# EAGLE board Powersupply_RevA_discrete (EAGLE 9.4.2), part 1 of 2
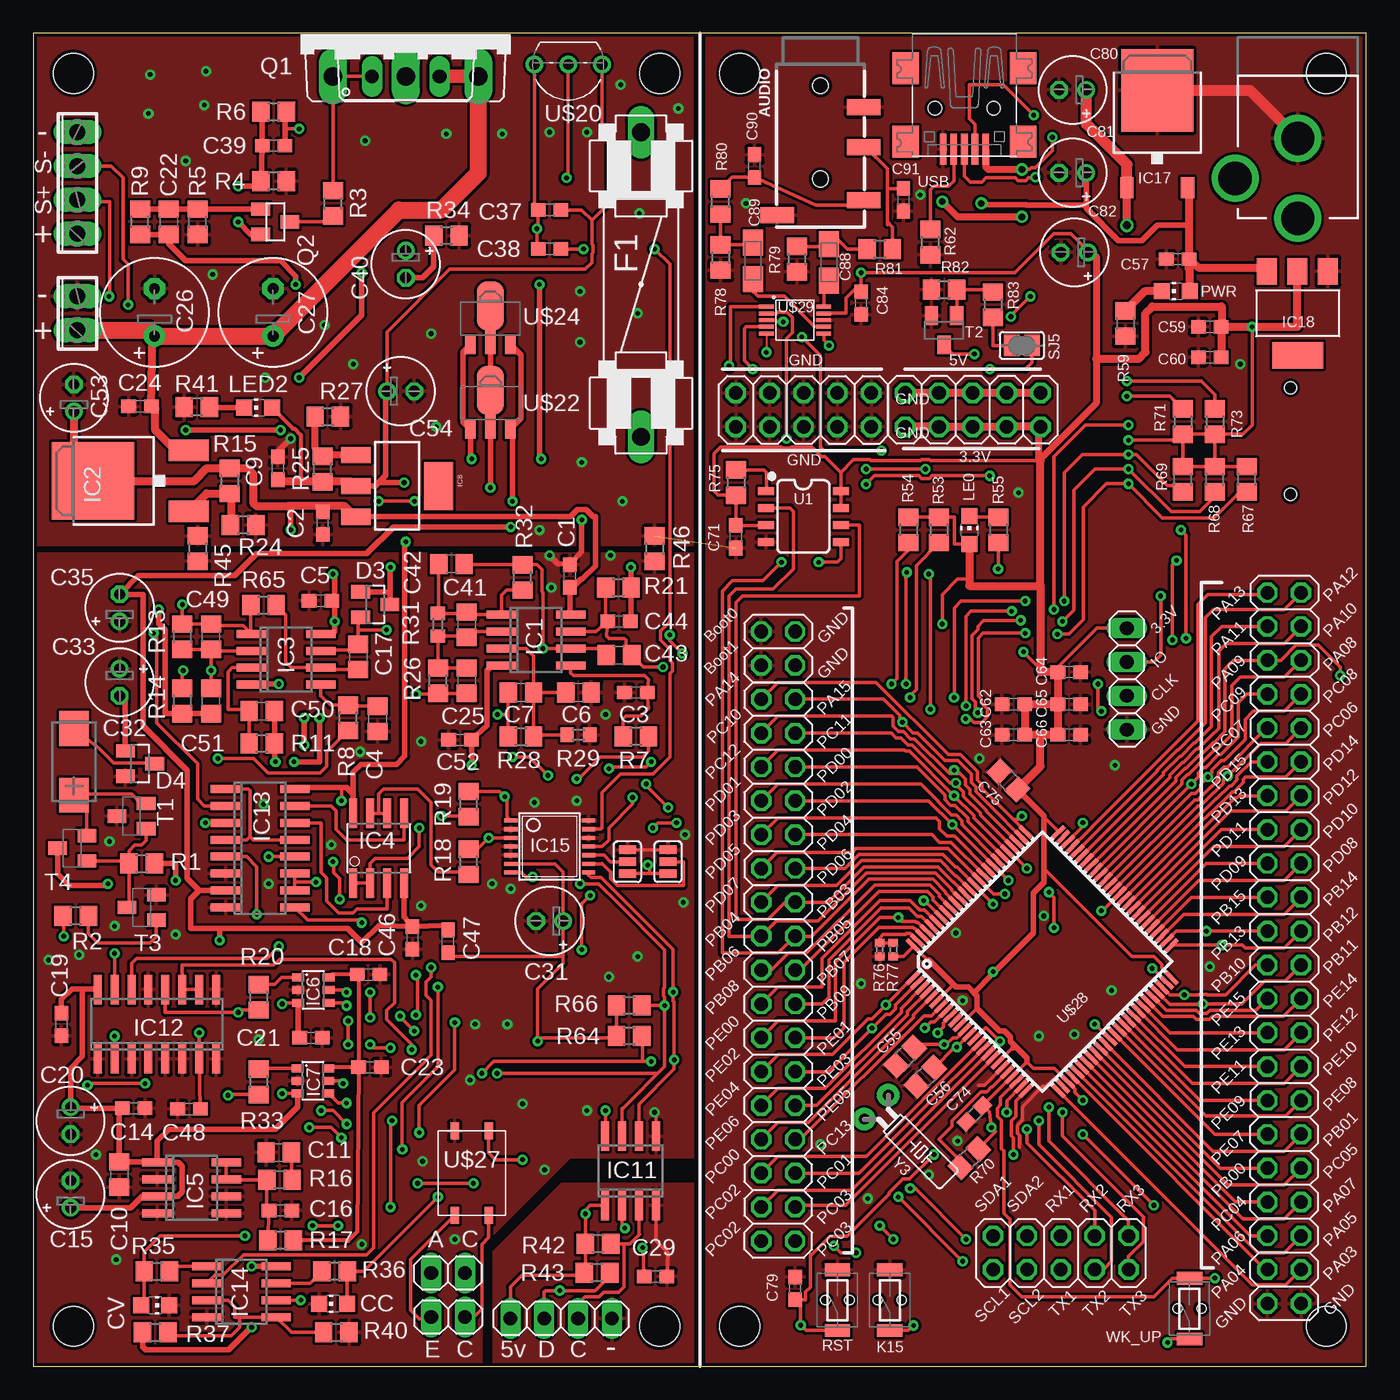
[diagram p2: board, top side]
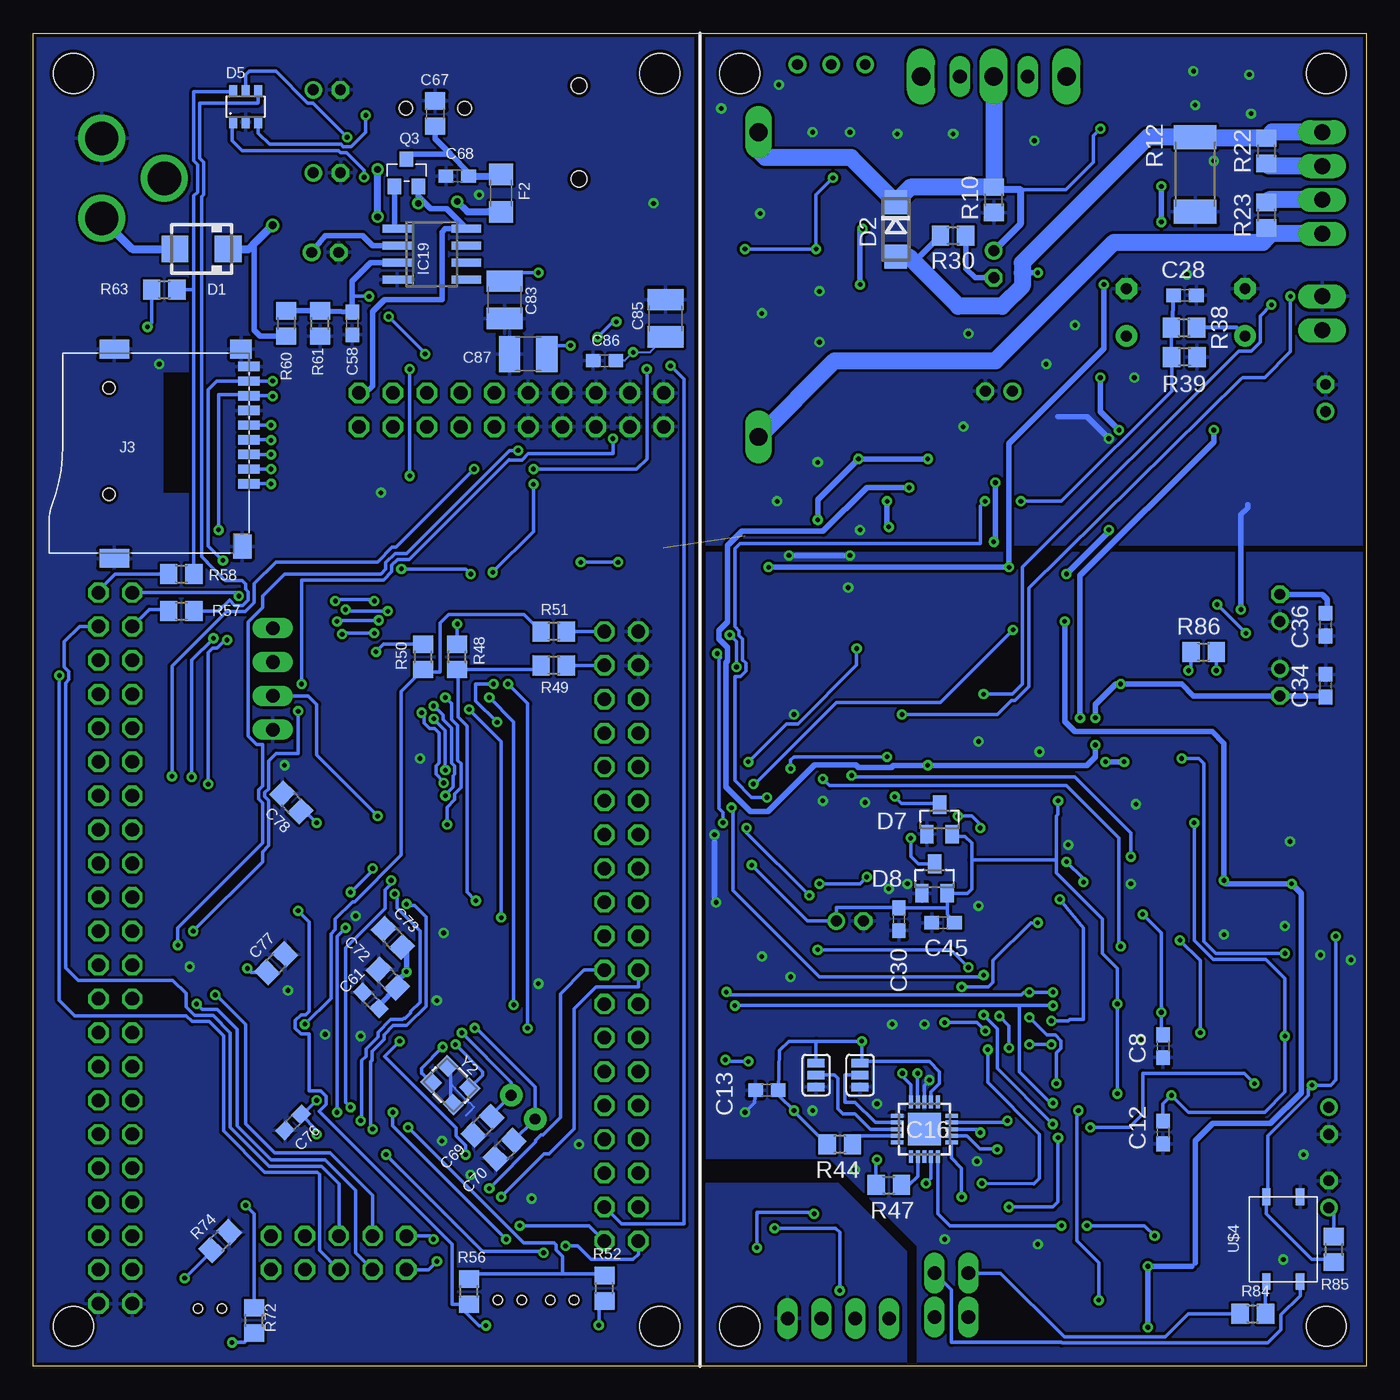
[diagram p3: board, bottom side, seen from below]

Size 100 x 100 mm. Coordinates in mm from the lower left corner, seen from the top.
Outline: 0,0 100,0 100,100 0,100 0,0
Copper layers (1*16): Top 0.035mm / dielectric 1.5mm / Bottom 0.035mm
Design rules "default *": minimum track width 6mil, minimum drill 0.35mm, track to track 6mil, track to pad 6mil, pad to pad 6mil, via to via 6mil, smd to smd 6mil, copper to edge 10mil, drill to drill 6mil, minimum pad ring 10mil, minimum via ring 8mil, stop-mask expansion 8mil, vias tented up to drill 0mil, thermal gap 10mil
Net classes: 0 default: clearance 0.205 mm
Holes 3 mm at 3,97 47,97 3,3 47,3 53,3 97,3 53,97 97,97

## Footprints (pad centres in the part's own frame; a part is rotated, then mirrored left to right if it is on the bottom)
AUDIO_JACK_3.5MM_TRRS_SMD_RA = smd 1.2 x 2.5: EARTH 11.3,-3.25; RING1 6.2,3.25; RING2 3.2,3.25; TIP 10.2,3.25 | hole 1.2: 1.6,0; 8.6,0
C0603 = smd 1.1 x 1: 1 -0.85,0; 2 0.85,0
C0805 = smd 1.3 x 1.5: 1 -0.95,0; 2 0.95,0
E2-5 = drill 0.813 pad 1.27: + -1.016,0 | drill 0.813 pad 1.27 octagon: - 1.016,0
E3,5-8 = drill 0.813 pad 1.6: + -1.778,0 | drill 0.813 pad 1.6 octagon: - 1.778,0
CT6032 = smd 2.6 x 2.2: + -2.5,0; - 2.5,0
C1210 = smd 1.6 x 2.7: 1 -1.4,0; 2 1.4,0
A/3216-18R = smd 1.95 x 1.5: + 1.375,0; - -1.375,0
CHIP-LED0805 = smd 1.2 x 1.2: A 0,-1.05; C 0,1.05
SMA = smd 2 x 2: A 2,0; C -2,0
DO214AC = smd 1.8 x 1.7: A 2.05,0; C -2.05,0
SOT23 = smd 1 x 1.4: 1 -0.95,-1.1; 2 0.95,-1.1; 3 0,1.1
SOT23-6 = smd 0.6 x 0.9: 1 -0.95,-1.15; 2 0,-1.15; 3 0.95,-1.15; 4 0.95,1.15; 5 0,1.15; 6 -0.95,1.15
FUSE = drill 1.321 long: 1 -11.43,0; 2 11.43,0
1206 = smd 1.6 x 1.8: 1 -1.4,0; 2 1.4,0
SO08 = smd 0.6 x 2.2: 1 -1.905,-2.6; 2 -0.635,-2.6; 3 0.635,-2.6; 4 1.905,-2.6; 5 1.905,2.6; 6 0.635,2.6; 7 -0.635,2.6; 8 -1.905,2.6
DPACK = smd 1.6 x 3: 1 -2.28,-4.8; 3 2.28,-4.8 | smd 5.8 x 6.2: 4 0,2.38
SO08' = smd 0.61 x 2.21: 1 -1.905,-2.616; 2 -0.635,-2.616; 3 0.635,-2.616; 4 1.905,-2.616; 5 1.905,2.616; 6 0.635,2.616; 7 -0.635,2.616; 8 -1.905,2.616
SO-08 = smd 0.6 x 2.2: 1 -1.905,-2.6; 2 -0.635,-2.6; 3 0.635,-2.6; 4 1.905,-2.6; 5 1.905,2.6; 6 0.635,2.6; 7 -0.635,2.6; 8 -1.905,2.6
SOT223 = smd 1.219 x 2.235: 1 -2.311,-3.099; 2 0,-3.099; 3 2.311,-3.099 | smd 3.6 x 2.2: 4 0,3.099
SO16 = smd 0.6 x 2.2: 1 -4.445,-2.6; 2 -3.175,-2.6; 3 -1.905,-2.6; 4 -0.635,-2.6; 5 0.635,-2.6; 6 1.905,-2.6; 7 3.175,-2.6; 8 4.445,-2.6; 9 4.445,2.6; 10 3.175,2.6; 11 1.905,2.6; 12 0.635,2.6; 13 -0.635,2.6; 14 -1.905,2.6; 15 -3.175,2.6; 16 -4.445,2.6
TSSOP14 = smd 0.305 x 0.991: 1 -1.95,-2.918; 2 -1.3,-2.918; 3 -0.65,-2.918; 4 0,-2.918; 5 0.65,-2.918; 6 1.3,-2.918; 7 1.95,-2.918; 8 1.95,2.918; 9 1.3,2.918; 10 0.65,2.918; 11 0,2.918; 12 -0.65,2.918; 13 -1.3,2.918; 14 -1.95,2.918
QFN20 = smd 0.95 x 0.3: 1 -2.05,1; 2 -2.05,0.5; 3 -2.05,0; 4 -2.05,-0.5; 5 -2.05,-1; 11 2.05,-1; 12 2.05,-0.5; 13 2.05,0; 14 2.05,0.5; 15 2.05,1 | smd 0.3 x 0.95: 6 -1,-2.05; 7 -0.5,-2.05; 8 0,-2.05; 9 0.5,-2.05; 10 1,-2.05; 16 1,2.05; 17 0.5,2.05; 18 0,2.05; 19 -0.5,2.05; 20 -1,2.05 | smd 2.45 x 2.45: EXP 0,0
TO252 = smd 1 x 1.6: 1 -2.28,-4.8; 2 2.28,-4.8 | smd 5.4 x 6.2: 3 0,2.5
SOT223' = smd 1.499 x 2.007: 1 -2.261,-3.15; 2 0.025,-3.15; 3 2.311,-3.15 | smd 3.81 x 2.007: 4 0,3.15
POWER_JACK_PTH = drill 2.5: GND 0,7.7; GNDBREAK 4.7,10.7; PWR 0,13.7
MICRO-SD9+4P-SMD-16.1X14.5X1.85MM = smd 1.6 x 0.7: 1 0,2.25; 2 0,1.15; 3 0,0.05; 4 0,-1.05; 5 0,-2.15; 6 0,-3.25; 7 0,-4.35; 8 0,-5.45; 9 0,-6.55 | smd 1.6 x 1.4: G1 0.6,-7.85 | smd 2.2 x 1.4: G2 10.1,-7.85; G3 10.1,7.85 | smd 1.4 x 1.8: G4 0.5,6.95 | hole 0.9: 10.5,-4.95; 10.5,3.05
1X02 = drill 1.016 long: 1 -1.27,0; 2 1.27,0
2X22 = drill 1.016 octagon: 1 -25.4,-1.27; 2 -25.4,1.27; 3 -22.86,-1.27; 4 -22.86,1.27; 5 -20.32,-1.27; 6 -20.32,1.27; 7 -17.78,-1.27; 8 -17.78,1.27; 9 -15.24,-1.27; 10 -15.24,1.27; 11 -12.7,-1.27; 12 -12.7,1.27; 13 -10.16,-1.27; 14 -10.16,1.27; 15 -7.62,-1.27; 16 -7.62,1.27; 17 -5.08,-1.27; 18 -5.08,1.27; 19 -2.54,-1.27; 20 -2.54,1.27; 21 0,-1.27; 22 0,1.27; 23 2.54,-1.27; 24 2.54,1.27; 25 5.08,-1.27; 26 5.08,1.27; 27 7.62,-1.27; 28 7.62,1.27; 29 10.16,-1.27; 30 10.16,1.27; 31 12.7,-1.27; 32 12.7,1.27; 33 15.24,-1.27; 34 15.24,1.27; 35 17.78,-1.27; 36 17.78,1.27; 37 20.32,-1.27; 38 20.32,1.27; 39 22.86,-1.27; 40 22.86,1.27; 41 25.4,-1.27; 42 25.4,1.27; 43 27.94,-1.27; 44 27.94,1.27
2X17 = drill 1.016 octagon: 1 -20.32,-1.27; 2 -20.32,1.27; 3 -17.78,-1.27; 4 -17.78,1.27; 5 -15.24,-1.27; 6 -15.24,1.27; 7 -12.7,-1.27; 8 -12.7,1.27; 9 -10.16,-1.27; 10 -10.16,1.27; 11 -7.62,-1.27; 12 -7.62,1.27; 13 -5.08,-1.27; 14 -5.08,1.27; 15 -2.54,-1.27; 16 -2.54,1.27; 17 0,-1.27; 18 0,1.27; 19 2.54,-1.27; 20 2.54,1.27; 21 5.08,-1.27; 22 5.08,1.27; 23 7.62,-1.27; 24 7.62,1.27; 25 10.16,-1.27; 26 10.16,1.27; 27 12.7,-1.27; 28 12.7,1.27; 29 15.24,-1.27; 30 15.24,1.27; 31 17.78,-1.27; 32 17.78,1.27; 33 20.32,-1.27; 34 20.32,1.27
2X02 = drill 1.016 octagon: 1 -1.27,-1.27; 2 -1.27,1.27; 3 1.27,-1.27; 4 1.27,1.27
2X05 = drill 1.016 octagon: 1 -5.08,-1.27; 2 -5.08,1.27; 3 -2.54,-1.27; 4 -2.54,1.27; 5 0,-1.27; 6 0,1.27; 7 2.54,-1.27; 8 2.54,1.27; 9 5.08,-1.27; 10 5.08,1.27
TACTILE_SWITCH_SMD_6.0X3.5MM = smd 0.95 x 1.9: 1 -2.275,0; 2 2.275,0 | hole 0.7: 0,-0.9; 0,0.9
TOP3AV = drill 1.397 long: B -5.461,-3.175; C 0,-3.175; E 5.461,-3.175
SOT-23 = smd 1.016 x 1.143: 1 -0.889,-1.016; 2 0.889,-1.016; 3 0,1.016
TO220AV = drill 1.016 long: B -2.54,-2.54; C 0,-2.54; E 2.54,-2.54
R0805 = smd 1.3 x 1.5: 1 -0.95,0; 2 0.95,0
R2512 = smd 1.8 x 3.2: 1 -2.8,0; 2 2.8,0
R0603 = smd 1 x 1.1: 1 -0.85,0; 2 0.85,0
R0402 = smd 0.6 x 0.7: 1 -0.5,0; 2 0.5,0
SJ_3 = smd 0.635 x 1.27: 1 -0.889,0; 2 0,0; 3 0.889,0
SJ = smd 1.168 x 1.6: 1 -0.762,0; 2 0.762,0
1X04 = drill 1.016 long: 1 -3.81,0; 2 -1.27,0; 3 1.27,0; 4 3.81,0
SOT23-BEC = smd 1 x 1.4: B -0.95,-1.1; C 0,1.1; E 0.95,-1.1
SO08'' = smd 0.6 x 1.2: 1 -1.905,-2.8; 2 -0.635,-2.8; 3 0.635,-2.8; 4 1.905,-2.8; 5 1.905,2.8; 6 0.635,2.8; 7 -0.635,2.8; 8 -1.905,2.8
EL357 = smd 1.27 x 0.635: 1 -2.54,1.27; 2 -2.54,-1.27; 3 3.81,-1.27; 4 3.81,1.27
TO92-BCE = drill 0.813: 1 -2.54,0; 2 0,0; 3 2.54,0
SOT89 = smd 0.8 x 1.4: 1 -1.499,-1.981; 3 1.499,-1.981 | smd 0.8 x 1.9: 2 0,-1.727 | smd 2.032 x 3.65: 2@1 0,0.94
LQFP100 = smd 1.2 x 0.32: 1 -7.75,6; 2 -7.75,5.5; 3 -7.75,5; 4 -7.75,4.5; 5 -7.75,4; 6 -7.75,3.5; 7 -7.75,3; 8 -7.75,2.5; 9 -7.75,2; 10 -7.75,1.5; 11 -7.75,1; 12 -7.75,0.5; 13 -7.75,0; 14 -7.75,-0.5; 15 -7.75,-1; 16 -7.75,-1.5; 17 -7.75,-2; 18 -7.75,-2.5; 19 -7.75,-3; 20 -7.75,-3.5; 21 -7.75,-4; 22 -7.75,-4.5; 23 -7.75,-5; 24 -7.75,-5.5; 25 -7.75,-6; 51 7.75,-6; 52 7.75,-5.5; 53 7.75,-5; 54 7.75,-4.5; 55 7.75,-4; 56 7.75,-3.5; 57 7.75,-3; 58 7.75,-2.5; 59 7.75,-2; 60 7.75,-1.5; 61 7.75,-1; 62 7.75,-0.5; 63 7.75,0; 64 7.75,0.5; 65 7.75,1; 66 7.75,1.5; 67 7.75,2; 68 7.75,2.5; 69 7.75,3; 70 7.75,3.5; 71 7.75,4; 72 7.75,4.5; 73 7.75,5; 74 7.75,5.5; 75 7.75,6 | smd 0.32 x 1.2: 26 -6,-7.75; 27 -5.5,-7.75; 28 -5,-7.75; 29 -4.5,-7.75; 30 -4,-7.75; 31 -3.5,-7.75; 32 -3,-7.75; 33 -2.5,-7.75; 34 -2,-7.75; 35 -1.5,-7.75; 36 -1,-7.75; 37 -0.5,-7.75; 38 0,-7.75; 39 0.5,-7.75; 40 1,-7.75; 41 1.5,-7.75; 42 2,-7.75; 43 2.5,-7.75; 44 3,-7.75; 45 3.5,-7.75; 46 4,-7.75; 47 4.5,-7.75; 48 5,-7.75; 49 5.5,-7.75; 50 6,-7.75; 76 6,7.75; 77 5.5,7.75; 78 5,7.75; 79 4.5,7.75; 80 4,7.75; 81 3.5,7.75; 82 3,7.75; 83 2.5,7.75; 84 2,7.75; 85 1.5,7.75; 86 1,7.75; 87 0.5,7.75; 88 0,7.75; 89 -0.5,7.75; 90 -1,7.75; 91 -1.5,7.75; 92 -2,7.75; 93 -2.5,7.75; 94 -3,7.75; 95 -3.5,7.75; 96 -4,7.75; 97 -4.5,7.75; 98 -5,7.75; 99 -5.5,7.75; 100 -6,7.75
TSSOP10 = smd 0.3 x 1.1: 1 -1,-2.15; 2 -0.5,-2.15; 3 0,-2.15; 4 0.5,-2.15; 5 1,-2.15; 6 1,2.15; 7 0.5,2.15; 8 0,2.15; 9 -0.5,2.15; 10 -1,2.15
USB-MINIB = smd 0.5 x 2.308: D+ 0,4.064; D- -0.8,4.064; GND 1.6,4.064; ID 0.8,4.064; VBUS -1.6,4.064 | smd 2 x 2.4: GND1 -4.4,-2; GND2 -4.4,3.5; GND3 4.4,3.5; GND4 4.4,-2 | hole 1: -2.2,1; 2.2,1
4POL254 = drill 1.2 long: 1 -3.81,0; 2 -1.27,0; 3 1.27,0; 4 3.81,0
2POL254 = drill 1.2 long: 1 -1.27,0; 2 1.27,0
CRYSTAL-SMD-3.2X2.5MM = smd 1.2 x 1.1: 1 -1.175,-0.875; 2 1.175,-0.875; 3 1.175,0.875; 4 -1.175,0.875
CRYSTAL-PTH-2X6-CYL = drill 0.813 pad 1.676: 1 -1.27,0; 2 1.27,0

## Placement (x,y rotation side)
AUDIO  AUDIO_JACK_TRRSSMD_RA  [AUDIO_JACK_3.5MM_TRRS_SMD_RA]  59.05,97.66 270 top
C1  100nf  [C0603]  40.26,59.28 90 top
C2  100nf  [C0603]  21.72,63.26 90 top
C3  100nf  [C0603]  45.21,50.55 180 top
C4  100nf  [C0805]  25.83,48.56 270 top
C5  100nf  [C0603]  21.54,57.43 0 top
C6  4.7n  [C0805]  40.89,50.55 0 top
C7  4.7n  [C0805]  36.58,50.55 180 top
C8  100nf  [C0603]  15.24,24 90 bottom
C9  100nf  [C0603]  18.34,67.37 270 top
C10  2.2uf  [C0805]  6.45,14.38 90 top
C11  2.2uf  [C0805]  18.41,16.03 180 top
C12  100nf  [C0603]  15.24,17.53 90 bottom
C13  100nf  [C0603]  44.96,20.7 0 bottom
C14  100nf  [C0603]  7.53,19.35 180 top
C15  10uf 16V  [E2-5]  2.79,12.9 90 top
C16  100nf  [C0603]  18.54,11.68 0 top
C17  15nf  [C0805]  24.38,53.21 90 top
C18  100nf  [C0603]  25.16,29.39 180 top
C19  100nf  [C0603]  2.11,25.64 90 top
C20  10uf 16V  [E2-5]  2.79,18.41 270 top
C21  100nf  [C0603]  20.83,24.64 180 top
C22  100nf  [C0805]  10.16,85.85 270 top
C23  100nf  [C0603]  25.26,22.43 180 top
C24  100nf  [C0603]  8,72.01 0 top
C25  4.7n  [C0805]  32.51,51.44 270 top
C26  220uf 25v  [E3,5-8]  9.09,79.07 90 top
C27  22uf 25v  [E3,5-8]  17.98,79.07 90 top
C28  100nf  [C0603]  13.59,80.34 180 bottom
C29  100nf  [C0603]  46.69,6.73 180 top
C30  100nf  [C0603]  35.05,33.53 90 bottom
C31  10uf 16V  [E2-5]  38.73,33.4 180 top
C32  47uf 25V  [CT6032]  3.05,45.34 90 top
C33  47uf 25V  [E2-5]  6.48,51.31 270 top
C34  100nf  [C0603]  3.05,51.05 270 bottom
C35  47uf 25V  [E2-5]  6.48,56.9 90 top
C36  100nf  [C0603]  3.05,55.63 90 bottom
C37  100nf  [C0603]  38.73,86.74 0 top
C38  100nf  [C0603]  38.73,83.82 0 top
C39  100nf  [C0603]  18.03,91.57 0 top
C40  47uf 25V  [E2-5]  27.94,82.68 270 top
C41  4.7n  [C0805]  32.51,55.63 270 top
C42  4.7n  [C0805]  31.37,60.2 180 top
C43  2.7n  [C0805]  43.94,53.34 0 top
C44  100nf  [C0603]  43.94,55.88 180 top
C45  100nf  [C0603]  31.75,33.27 0 bottom
C46  100nf  [C0603]  28.45,32.13 270 top
C47  100nf  [C0603]  31.11,31.88 90 top
C48  100nf  [C0603]  11.68,19.3 180 top
C49  4.7n  [C0805]  13.34,54.74 270 top
C50  4.7n  [C0805]  17.14,49.15 0 top
C51  4.7n  [C0805]  13.34,49.91 90 top
C52  100nf  [C0603]  32,46.99 180 top
C53  47uf 16V  [E2-5]  3.05,72.64 90 top
C54  47uf 16V  [E2-5]  27.56,73.15 0 top
C55  22pf  [C0805]  65.41,23.24 225 top
C56  22pf  [C0805]  66.93,21.72 225 top
C57  100nf  [C0603]  85.85,83.06 180 top
C58  100nf  [C0603]  76.07,78.23 270 bottom
C59  100nf  [C0603]  88.27,77.98 180 top
C60  100nf  [C0603]  88.27,75.69 180 top
C61  100nf  [C0603]  74.68,27.43 315 bottom
C62  100nf  [C0603]  73.53,49.66 0 top
C63  100nf  [C0603]  73.53,47.37 0 top
C64  100nf  [C0603]  77.72,52.07 0 top
C65  100nf  [C0603]  77.72,49.66 0 top
C66  100nf  [C0603]  77.72,47.37 0 top
C67  10uf  [C0805]  69.85,93.98 270 bottom
C68  100nf  [C0603]  68.2,89.28 0 bottom
C69  10pf  [C0805]  66.29,18.03 225 bottom
C70  10pf  [C0805]  64.64,16.26 225 bottom
C71  100nf  [C0603]  52.7,62.23 90 top
C72  1uf  [C0805]  73.41,29.08 135 bottom
C73  1uf  [C0805]  73.03,32.13 135 bottom
C74  100nf  [C0603]  70.61,18.92 225 top
C75  1uf  [C0805]  73.15,43.94 135 top
C76  100nf  [C0603]  80.52,18.29 225 bottom
C77  2.2uf  [C0805]  81.79,30.23 45 bottom
C78  2.2uf  [C0805]  80.64,42.29 135 bottom
C79  100nf  [C0603]  57.15,5.84 90 top
C80  47uf 16V  [E2-5]  77.98,95.76 180 top
C81  47uf 16V  [E2-5]  77.98,89.53 180 top
C82  47uf 16V  [E2-5]  78.11,83.57 180 top
C83  10uf  [C1210]  64.64,80.01 90 bottom
C84  100nf  [C0603]  62.1,79.76 90 top
C85  10uf  [C1210]  52.58,78.61 90 bottom
C86  100nf  [C0603]  57.15,75.44 180 bottom
C87  10uf  [C1210]  62.87,75.95 180 bottom
C88  3.3uf  [A/3216-18R]  59.69,82.8 270 top
C89  3.3uf  [A/3216-18R]  53.98,82.93 270 top
C90  100nf  [C0603]  54.1,90.04 90 top
C91  100nf  [C0603]  65.28,87.5 270 top
CC  Red  [CHIP-LED0805]  22.48,4.7 90 top
CV  Red  [CHIP-LED0805]  9.14,4.57 270 top
D1  S1M  [SMA]  87.38,83.82 180 bottom
D2  SMAJ13A  [DO214AC]  35.31,85.29 270 bottom
D3  BAS40-04  [SOT23]  25.65,57.15 270 top
D4  BAS40-04  [SOT23]  8,45.21 270 top
D5  USBLC6-2P  [SOT23-6]  84.07,94.49 0 bottom
D7  BAS40-04  [SOT23]  32,41.02 0 bottom
D8  BAS40-04  [SOT23]  32.38,36.58 0 bottom
F1  2A  [FUSE]  45.59,81.15 270 top
F2  6V/0.5A  [1206]  64.9,88.01 90 bottom
IC1  OPA2196  [SO08]  37.72,54.48 270 top
IC2  LM317MABDT  [DPACK]  6.86,66.42 90 top
IC3  OPA2197  [SO08]  18.97,53.04 270 top
IC4  OPA2197  [SO08']  25.91,38.86 0 top
IC5  MCP1501-20E/SN  [SO-08]  11.89,13.39 270 top
IC6  MCP4726  [SOT23-6]  21.01,28.22 270 top
IC7  MCP4726  [SOT23-6]  20.98,21.41 270 top
IC8  V_REG_317SMD  [SOT223]  27.3,66.04 270 top
IC11  ISO1541D  [SO-08]  44.81,14.66 0 top
IC12  744053S  [SO16]  9.27,25.65 0 top
IC13  744053S  [SO16]  17.02,38.86 270 top
IC14  LM358D  [SO08]  15.62,5.59 270 top
IC15  MCP3428TSSOP  [TSSOP14]  38.73,38.99 270 top
IC16  MCP23008QFN20  [QFN20]  33.15,17.78 0 bottom
IC17  7805DT  [TO252]  84.33,93.22 0 top
IC18  REG1117  [SOT223']  94.87,78.99 180 top
IC19  LM358D  [SO08]  70.1,83.44 270 bottom
J2  POWER_JACK  [POWER_JACK_PTH]  94.87,99.82 180 top
J3  MICROSD-9P  [MICRO-SD9+4P-SMD-16.1X14.5X1.85MM]  83.82,68.45 180 bottom
JP1  [1X02]  31.11,3.68 0 top
JP2  IO1  [2X22]  93.85,32.64 270 top
JP3  IO2  [2X17]  55.88,29.72 270 top
JP4  Bootloader  [2X02]  55.88,53.85 270 top
JP5  Communication  [2X05]  77.09,8.51 0 top
JP6  GND  [2X05]  70.48,71.75 180 top
JP7  Power  [2X05]  57.78,71.75 0 top
JP8  Pump  [1X02]  31.11,6.99 180 top
K15  SWITCH-SWITCH-SMD-3.0X4.0X2.0MM  [TACTILE_SWITCH_SMD_6.0X3.5MM]  64.26,4.95 90 top
LE0  LE0  [CHIP-LED0805]  70.23,62.74 0 top
LED2  Red  [CHIP-LED0805]  16.87,71.91 90 top
PWR  Red  [CHIP-LED0805]  85.72,80.64 90 top
Q1  TIP147  [TOP3AV]  27.94,99.95 0 top
Q2  2N7002  [SOT23]  18.16,85.85 270 top
Q3  FDN340P  [SOT-23]  72.01,89.53 0 bottom
Q4  TIP147  [TO220AV]  27.94,99.31 0 top
R1  680R  [R0805]  8.13,37.72 0 top
R2  2.2k  [R0805]  3.17,33.78 180 top
R3  6.8k  [R0805]  22.48,87.25 90 top
R4  470R  [R0805]  18.03,88.9 180 top
R5  2.2k  [R0805]  12.32,85.85 90 top
R6  6.8k  [R0805]  18.03,94.11 0 top
R7  6.8k  [R0805]  45.21,47.24 180 top
R8  6.8k  [R0805]  23.62,48.64 90 top
R9  2.2k  [R0805]  8,85.85 90 top
R10  1k  [R0805]  27.94,87.5 90 bottom
R11  10k  [R0805]  17.14,46.74 0 top
R12  0R100  [R2512]  12.83,89.41 90 bottom
R13  18k 0.1%  [R0805]  11.18,54.74 270 top
R14  1k 0.1%  [R0805]  11.18,49.91 270 top
R15  240  [R0805]  14.73,66.42 270 top
R16  50R  [R0805]  18.47,13.97 180 top
R17  0R  [R0805]  18.55,9.45 180 top
R18  100R  [R0805]  32.64,37.85 270 top
R19  100R  [R0805]  32.64,42.16 270 top
R20  220R  [R0805]  16.89,27.69 270 top
R21  2.2k  [R0805]  43.89,58.42 0 top
R22  12R  [R0805]  7.49,91.19 270 bottom
R23  12R  [R0805]  7.49,86.36 270 bottom
R24  2.2k  [R0805]  15.75,63.12 180 top
R25  220R  [R0805]  21.72,67.31 90 top
R26  18k 0.1%  [R0805]  30.35,51.44 90 top
R27  680R  [R0805]  22.1,71.25 0 top
R28  18k 0.1%  [R0805]  36.58,47.24 0 top
R29  1.8k 0.1%  [R0603]  40.89,47.37 0 top
R30  0R  [R0805]  30.99,84.84 0 bottom
R31  1.8k 0.1%  [R0603]  30.35,55.63 270 top
R32  2.2k  [R0805]  36.7,59.18 90 top
R33  220R  [R0805]  16.89,21.34 270 top
R34  NC  [R0805]  30.99,84.84 0 top
R35  6.8k  [R0805]  9.27,7.11 0 top
R36  6.8k  [R0805]  22.61,7.11 180 top
R37  2.2k  [R0805]  9.14,2.54 0 top
R38  39k  [R0805]  13.67,77.93 0 bottom
R39  1k  [R0805]  13.64,75.72 180 bottom
R40  6.8k  [R0805]  22.73,2.54 0 top
R41  2k  [R0805]  12.27,71.96 180 top
R42  1k  [R0805]  42.37,9.19 180 top
R43  1k  [R0805]  42.29,7.01 180 top
R44  50R  [R0805]  39.5,16.64 180 bottom
R45  0R  [R0805]  12.32,61.34 270 top
R46  0R  [R0805]  46.61,61.34 270 top
R47  470R  [R0805]  35.81,13.59 0 bottom
R48  10k  [R0805]  68.2,53.21 90 bottom
R49  510R  [R0805]  60.96,52.58 180 bottom
R50  10k  [R0805]  70.74,53.21 90 bottom
R51  510R  [R0805]  60.96,55.12 180 bottom
R52  10k  [R0805]  57.15,5.84 90 bottom
R53  10k  [R0805]  67.94,62.74 270 top
R54  10k  [R0805]  65.66,62.74 270 top
R55  500R  [R0805]  72.39,62.74 270 top
R56  10k  [R0805]  67.31,5.59 90 bottom
R57  20R  [R0805]  88.9,56.64 0 bottom
R58  20R  [R0805]  88.9,59.44 0 bottom
R59  250R  [R0805]  81.92,78.23 270 top
R60  10k  [R0805]  81.03,78.23 270 bottom
R61  10k  [R0805]  78.49,78.23 90 bottom
R62  100k  [R0805]  67.31,84.33 90 top
R63  1.5k  [R0805]  90.17,80.77 0 bottom
R64  6.8k  [R0805]  44.7,24.77 180 top
R65  1k  [R0805]  17.27,57.1 0 top
R66  6.8k  [R0805]  44.7,27.05 180 top
R67  10k  [R0805]  91.06,66.55 90 top
R68  10k  [R0805]  88.65,66.55 90 top
R69  10k  [R0805]  86.23,66.55 90 top
R70  0R  [R0805]  70.23,15.62 45 top
R71  10k  [R0805]  86.23,70.87 270 top
R72  10k  [R0805]  83.44,3.43 90 bottom
R73  10k  [R0805]  88.65,70.87 270 top
R74  20k  [R0805]  85.98,9.4 225 bottom
R75  10k  [R0805]  52.7,66.29 270 top
R76  0R  [R0402]  63.5,31.24 90 top
R77  NP  [R0402]  64.52,31.24 90 top
R78  10k  [R0805]  51.56,83.19 270 top
R79  20R  [R0805]  57.28,83.06 270 top
R80  470R  [R0805]  51.56,87.38 90 top
R81  470R  [R0805]  63.5,83.82 0 top
R82  10k  [R0805]  68.33,80.77 0 top
R83  10k  [R0805]  72.01,79.63 270 top
R84  470R  [R0805]  8.51,3.94 0 bottom
R85  10k  [R0805]  2.41,8.76 90 bottom
R86  1k 0.1%  [R0805]  12.19,53.59 0 bottom
RST  SWITCH-SWITCH-SMD-3.0X4.0X2.0MM  [TACTILE_SWITCH_SMD_6.0X3.5MM]  60.33,4.95 90 top
SJ1  [SJ_3]  41.27,21.84 270 bottom
SJ2  [SJ_3]  37.97,21.84 270 bottom
SJ3  [SJ_3]  44.58,37.85 90 top
SJ4  [SJ_3]  47.62,37.85 90 top
SJ5  [SJ]  74.17,76.58 180 top
SV1  STlLINK_V2  [1X04]  82.04,51.56 90 top
SV3  Control1  [1X04]  39.6,3.58 180 top
T1  PMBT3906  [SOT23-BEC]  7.37,41.27 90 top
T2  BC847  [SOT23]  68.33,77.72 180 top
T3  MMBT2222A  [SOT23-BEC]  8.13,34.42 90 top
T4  MMBT2222A  [SOT23-BEC]  2.92,38.86 90 top
U1  W25Q32  [SO08'']  57.78,63.75 270 top
U$4  EL357  [EL357]  6.22,8.89 90 bottom
U$20  MCP9700  [TO92-BCE]  40.13,97.66 180 top
U$22  L79L05SOT89  [SOT89]  34.29,72.26 0 top
U$24  L79L05SOT89  [SOT89]  34.29,78.61 0 top
U$27  EL357  [EL357]  32.89,15.11 270 top
U$28  STM32F427VIT6  [LQFP100]  75.69,30.35 45 top
U$29  CS4344  [TSSOP10]  57.15,78.49 270 top
USB  USB-FS  [USB-MINIB]  69.85,95.38 180 top
WK_UP  SWITCH-SWITCH-SMD-3.0X4.0X2.0MM  [TACTILE_SWITCH_SMD_6.0X3.5MM]  86.74,4.32 90 top
X1  [4POL254]  3.3,88.77 90 top
X3  [2POL254]  3.3,78.99 90 top
Y2  25Mhz  [CRYSTAL-SMD-3.2X2.5MM]  68.71,21.08 315 bottom
Y3  32.768kHz  [CRYSTAL-PTH-2X6-CYL]  63.25,19.43 225 top